# Altium schematic sheet SCH1.SchDoc
size A4; SheetNumber: 1; SheetTotal: 1
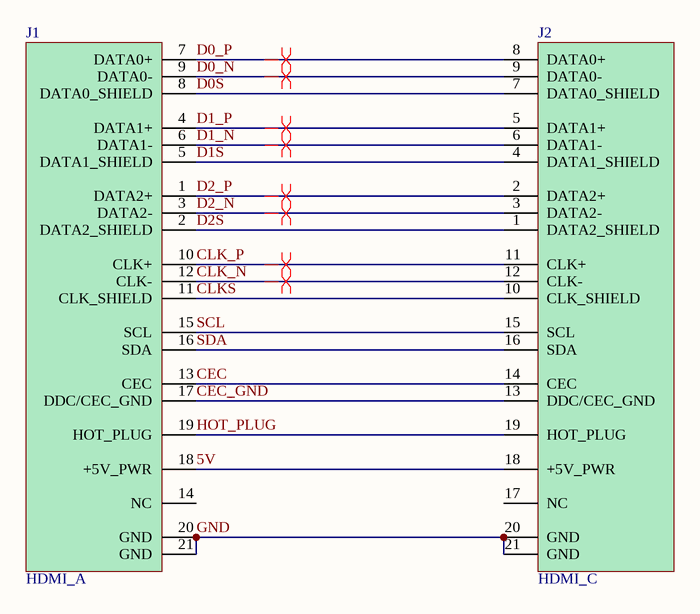
[diagram p0: SCH1.SchDoc]

## Parts
J1  HDMI_A  [HDMI_A_Plug_19P]
J2  HDMI_C  [HDMI_C_Plug_19P]

## Nets
5V: J1.18(+5V_PWR) J2.18(+5V_PWR)
CEC: J1.13(CEC) J2.14(CEC)
CEC_GND: J1.17(DDC/CEC_GND) J2.13(DDC/CEC_GND)
CLK_N: J1.12(CLK-) J2.12(CLK-)
CLK_P: J1.10(CLK+) J2.11(CLK+)
CLKS: J1.11(CLK_SHIELD) J2.10(CLK_SHIELD)
D0_N: J1.9(DATA0-) J2.9(DATA0-)
D0_P: J1.7(DATA0+) J2.8(DATA0+)
D0S: J1.8(DATA0_SHIELD) J2.7(DATA0_SHIELD)
D1_N: J1.6(DATA1-) J2.6(DATA1-)
D1_P: J1.4(DATA1+) J2.5(DATA1+)
D1S: J1.5(DATA1_SHIELD) J2.4(DATA1_SHIELD)
D2_N: J1.3(DATA2-) J2.3(DATA2-)
D2_P: J1.1(DATA2+) J2.2(DATA2+)
D2S: J1.2(DATA2_SHIELD) J2.1(DATA2_SHIELD)
GND: J1.20(GND) J1.21(GND) J2.20(GND) J2.21(GND)
HOT_PLUG: J1.19(HOT_PLUG) J2.19(HOT_PLUG)
SCL: J1.15(SCL) J2.15(SCL)
SDA: J1.16(SDA) J2.16(SDA)

Not connected (* = marked no-connect by the designer): J1 14(NC); J2 17(NC)

## Layout directives
differential pair: CLK_N, CLK_P, D0_N, D0_P, D1_N, D1_P, D2_N, D2_P

## Library data of the parts
J1 = HDMI_A_Plug_19P: HDMI A公头插板19pin
J2 = HDMI_C_Plug_19P: HDMI C公头插板19pin